# Altium schematic sheet Demo.SchDoc: Joule Heater
size A4
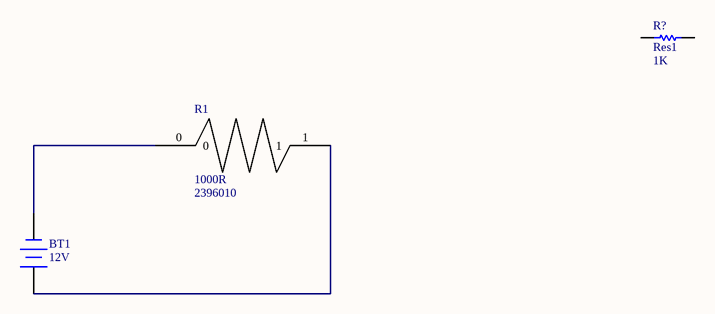
[diagram p0: Demo.SchDoc]

## Parts
BT1  12V  [BAT-2]
R1  1000R  Supplier Part Number 1: 2396010  [Resistor-Through]
R?  Res1  value 1K  [AXIAL-0.3]

## Nets
NetBT1_1: BT1.1(+) R1.1
NetBT1_2: BT1.2(-) R1.0

Not connected (* = marked no-connect by the designer): R? 1 2

## Library data of the parts
BT1 = Battery: Multicell Battery; Published: 24-Mar-1999; LatestRevisionDate: 17-Jul-2002; LatestRevisionNote: Re-released for DXP Platform.; PackageReference: BAT-2; Publisher: Altium Limited; PackageDescription: Battery; 2 Leads
R1 = Component_1: Supplier 1: Farnell
R? = Res1: Resistor; Published: 8-Jun-2000; LatestRevisionDate: 17-Jul-2002; LatestRevisionNote: Re-released for DXP Platform.; PackageReference: AXIAL-0.3; Publisher: Altium Limited; PackageDescription: Axial Device, Thru-Hole; 2 Leads; 0.3 in Pin Spacing